# EasyEDA schematic 1-Schematic_CessnaCitationX_Center.json
TITLE: Center; REV: 1.0; Date: 2018-11-17; Sheet: 1/1; Drawn By: F-ORKI
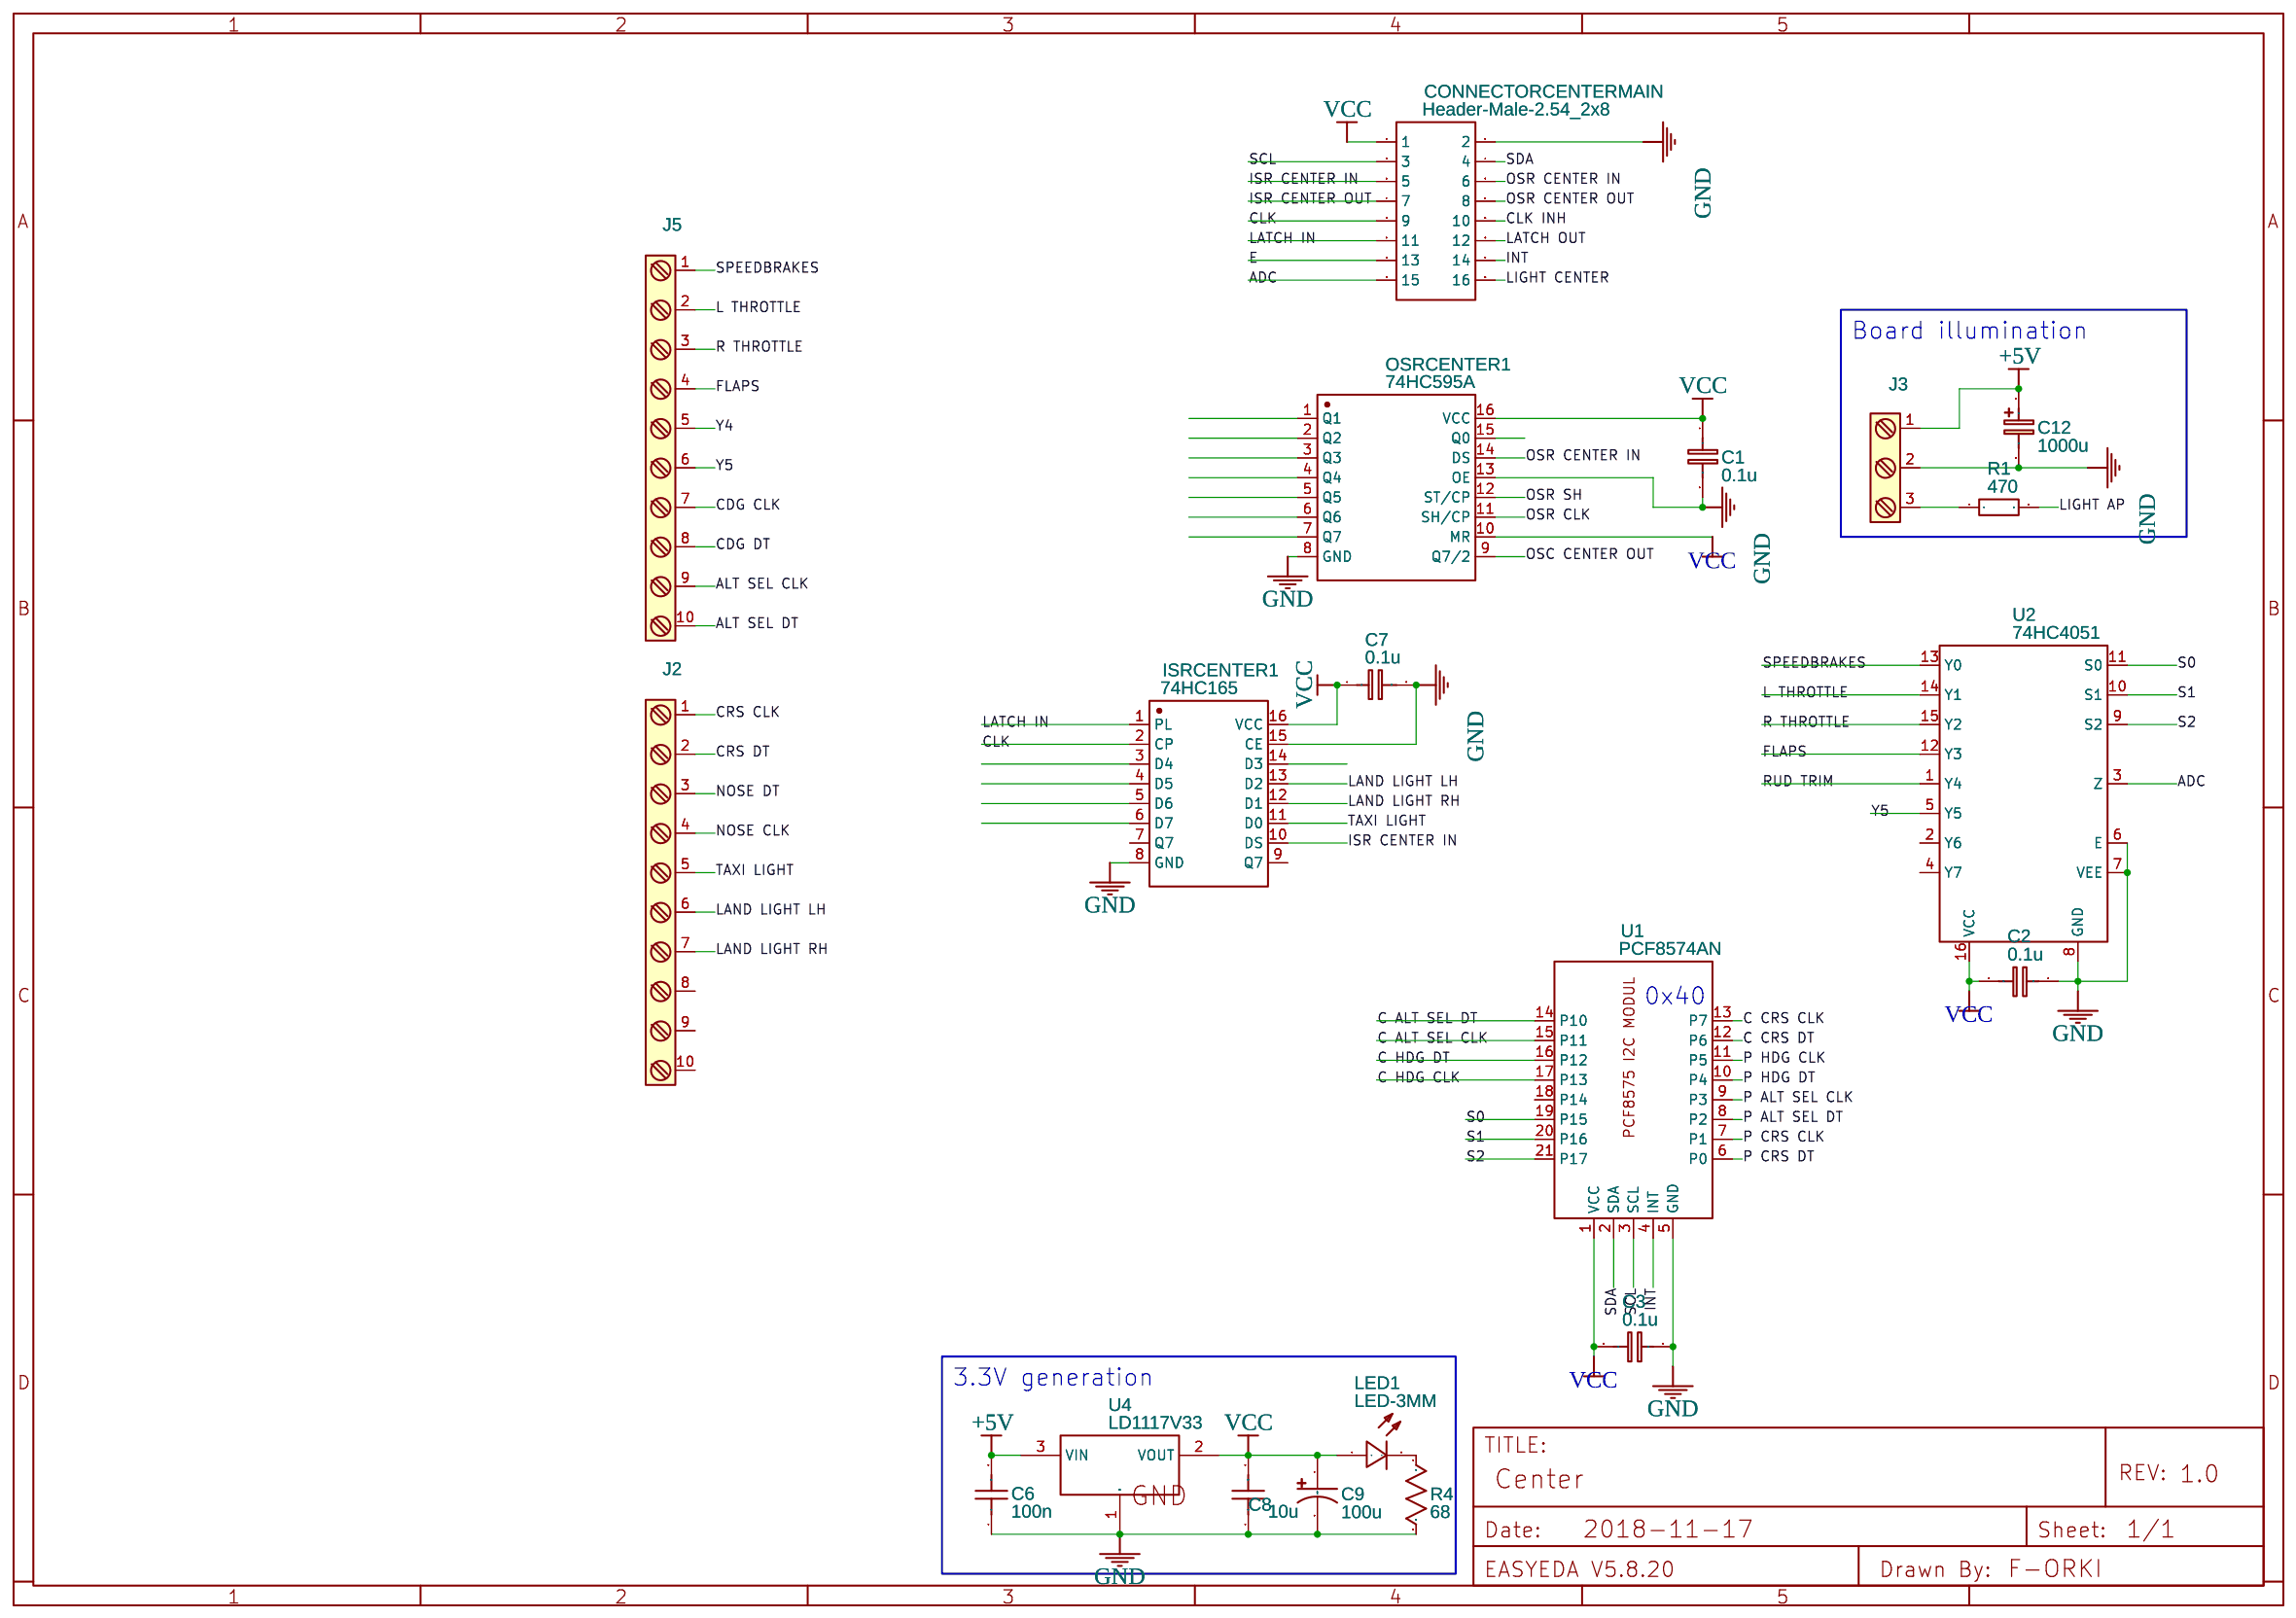
[diagram p0: schematic sheet]

## Parts
C1  0.1u  [RAD-0.1]
C2  0.1u  [RAD-0.1]
C3  0.1u  [RAD-0.1]
C6  100n  [RAD-0.1]
C7  0.1u  [RAD-0.1]
C8  10u  [RAD-0.1]
C9  100u  [CAP-D3.0XF1.5]
C12  1000u  [CAP-D3.0XF1.5]
CONNECTORCENTERMAIN  Header-Male-2.54_2x8  [HDR-8X2/2.54]
ISRCENTER1  74HC165  [DIP16]
J2  Screw_Terminal_1x10  [SIP-10]
J3  Screw_Terminal_1x03  [SIP-3-2.54MM]
J5  Screw_Terminal_1x10  [SIP-10]
LED1  LED-3MM  [LED-3MM/2.54]
OSRCENTER1  74HC595A  [DIP-16]
R1  470  [AXIAL-0.3]
R4  68  [AXIAL-0.3]
U1  PCF8574AN  [PCF8575 I2C MODUL]
U2  74HC4051  [DIL16-O]
U4  LD1117V33  [TO-220(TO-220-3)]

## Library data of the parts
C1-C3 C7 = Cap_RAD-0.1_EU: Manufacturer Part: ?
C6 C8 = Cap_RAD-0.1_US: Manufacturer Part: ?
C9 = Cap_Electrolytic(TH)_D3.0XF1.5_US: Manufacturer Part: ?
C12 = Cap_Electrolytic(TH)_D3.0XF1.5_EU: Contributor: EasyEDA; Manufacturer Part: ?
CONNECTORCENTERMAIN = -: Supplier Part: C68234; Supplier: LCSC; Manufacturer: BOOMELE; Manufacturer Part: Double row straight 2*8Headers  Pins 2.54mm; image: //image.lceda.cn/szlcsc/C68234.jpg
ISRCENTER1 = -: Supplier: LCSC; Manufacturer: Nexperia; Manufacturer Part: 74HC165D,653; LCSC Assembly: Yes; image: //image.lceda.cn/szlcsc/C5613.jpg; Contributor: LCSC; Supplier Part: C5613
J2 J3 J5 = -: Contributor: KiCAD; license: https://www.gnu.org/licenses/lgpl-2.1.html; Manufacturer Part: ?
LED1 = -: Supplier: LCSC; Manufacturer: EVERLIGHT; Manufacturer Part: 204-10SURD/S530-A3; Supplier Part: C99772
OSRCENTER1 = -: Supplier: LCSC; Manufacturer: FM; Contributor: LCSC; Supplier Part: C110383
R1 = Res_AXIAL-0.3(1/8W)_EU: Manufacturer Part: ?
R4 = Res_AXIAL-0.3(1/8W)_US: Manufacturer Part: ?
U1 = -: Manufacturer Part: ?
U2 = -: Contributor: Ftec; Manufacturer Part: ?
U4 = -: Supplier: LCSC; Supplier Part: C283467; Manufacturer: STMicroelectronics; Contributor: LCSC

## Nets
+5V: C6.2 C12.1 J3.1 U4.3(VIN)
GND: C1.2 C2.1 C3.1 C6.1 C7.2 C8.1 C9.2 C12.2 CONNECTORCENTERMAIN.2 ISRCENTER1.8(GND) ISRCENTER1.15(CE) J3.2 OSRCENTER1.8(GND) OSRCENTER1.13(OE) R4.2 U1.5(GND) U2.6(E) U2.7(VEE) U2.8(GND) U4.1(GND)
VCC: C1.1 C2.2 C3.2 C7.1 C8.2 C9.1 CONNECTORCENTERMAIN.1 ISRCENTER1.16(VCC) LED1.1(+) OSRCENTER1.10(MR) OSRCENTER1.16(VCC) U1.1(VCC) U2.16(VCC) U4.2(VOUT)
ADC: CONNECTORCENTERMAIN.15 U2.3(Z)
ALT SEL CLK: J5.9
ALT SEL DT: J5.10
C ALT SEL CLK: U1.15(P11)
C ALT SEL DT: U1.14(P10)
C CRS CLK: U1.13(P7)
C CRS DT: U1.12(P6)
C HDG CLK: U1.17(P13)
C HDG DT: U1.16(P12)
CDG CLK: J5.7
CDG DT: J5.8
CLK: CONNECTORCENTERMAIN.9 ISRCENTER1.2(CP)
CLK INH: CONNECTORCENTERMAIN.10
CRS CLK: J2.1
CRS DT: J2.2
E: CONNECTORCENTERMAIN.13
FLAPS: J5.4 U2.12(Y3)
INT: CONNECTORCENTERMAIN.14 U1.4(INT)
ISR CENTER IN: CONNECTORCENTERMAIN.5 ISRCENTER1.10(DS)
ISR CENTER OUT: CONNECTORCENTERMAIN.7
L THROTTLE: J5.2 U2.14(Y1)
LAND LIGHT LH: ISRCENTER1.13(D2) J2.6
LAND LIGHT RH: ISRCENTER1.12(D1) J2.7
LATCH IN: CONNECTORCENTERMAIN.11 ISRCENTER1.1(PL)
LATCH OUT: CONNECTORCENTERMAIN.12
LIGHT AP: R1.2
LIGHT CENTER: CONNECTORCENTERMAIN.16
NOSE CLK: J2.4
NOSE DT: J2.3
OSC CENTER OUT: OSRCENTER1.9(Q7/2)
OSR CENTER IN: CONNECTORCENTERMAIN.6 OSRCENTER1.14(DS)
OSR CENTER OUT: CONNECTORCENTERMAIN.8
OSR CLK: OSRCENTER1.11(SH/CP)
OSR SH: OSRCENTER1.12(ST/CP)
P ALT SEL CLK: U1.9(P3)
P ALT SEL DT: U1.8(P2)
P CRS CLK: U1.7(P1)
P CRS DT: U1.6(P0)
P HDG CLK: U1.11(P5)
P HDG DT: U1.10(P4)
R THROTTLE: J5.3 U2.15(Y2)
RUD TRIM: U2.1(Y4)
S0: U1.19(P15) U2.11(S0)
S1: U1.20(P16) U2.10(S1)
S2: U1.21(P17) U2.9(S2)
SCL: CONNECTORCENTERMAIN.3 U1.3(SCL)
SDA: CONNECTORCENTERMAIN.4 U1.2(SDA)
SPEEDBRAKES: J5.1 U2.13(Y0)
TAXI LIGHT: ISRCENTER1.11(D0) J2.5
Y4: J5.5
Y5: J5.6 U2.5(Y5)
Net-(J3-3): J3.3 R1.1
Net-(LED1-2): LED1.2(-) R4.1

Not connected (* = marked no-connect by the designer): ISRCENTER1 3(D4) 4(D5) 5(D6) 6(D7) 7(Q7) 9(Q7) 14(D3); J2 8 9 10; OSRCENTER1 1(Q1) 2(Q2) 3(Q3) 4(Q4) 5(Q5) 6(Q6) 7(Q7) 15(Q0); U1 18(P14); U2 2(Y6) 4(Y7)

## Notes on the sheet
- Board illumination
- 0x40
- 3.3V generation
